# Altium schematic sheet Pg06_ SysBoot_LEDS_Mech.SchDoc: SYSBOOT LED SENSORS
size A2; DocumentNumber: 6; SheetNumber: 6; SheetTotal: 16
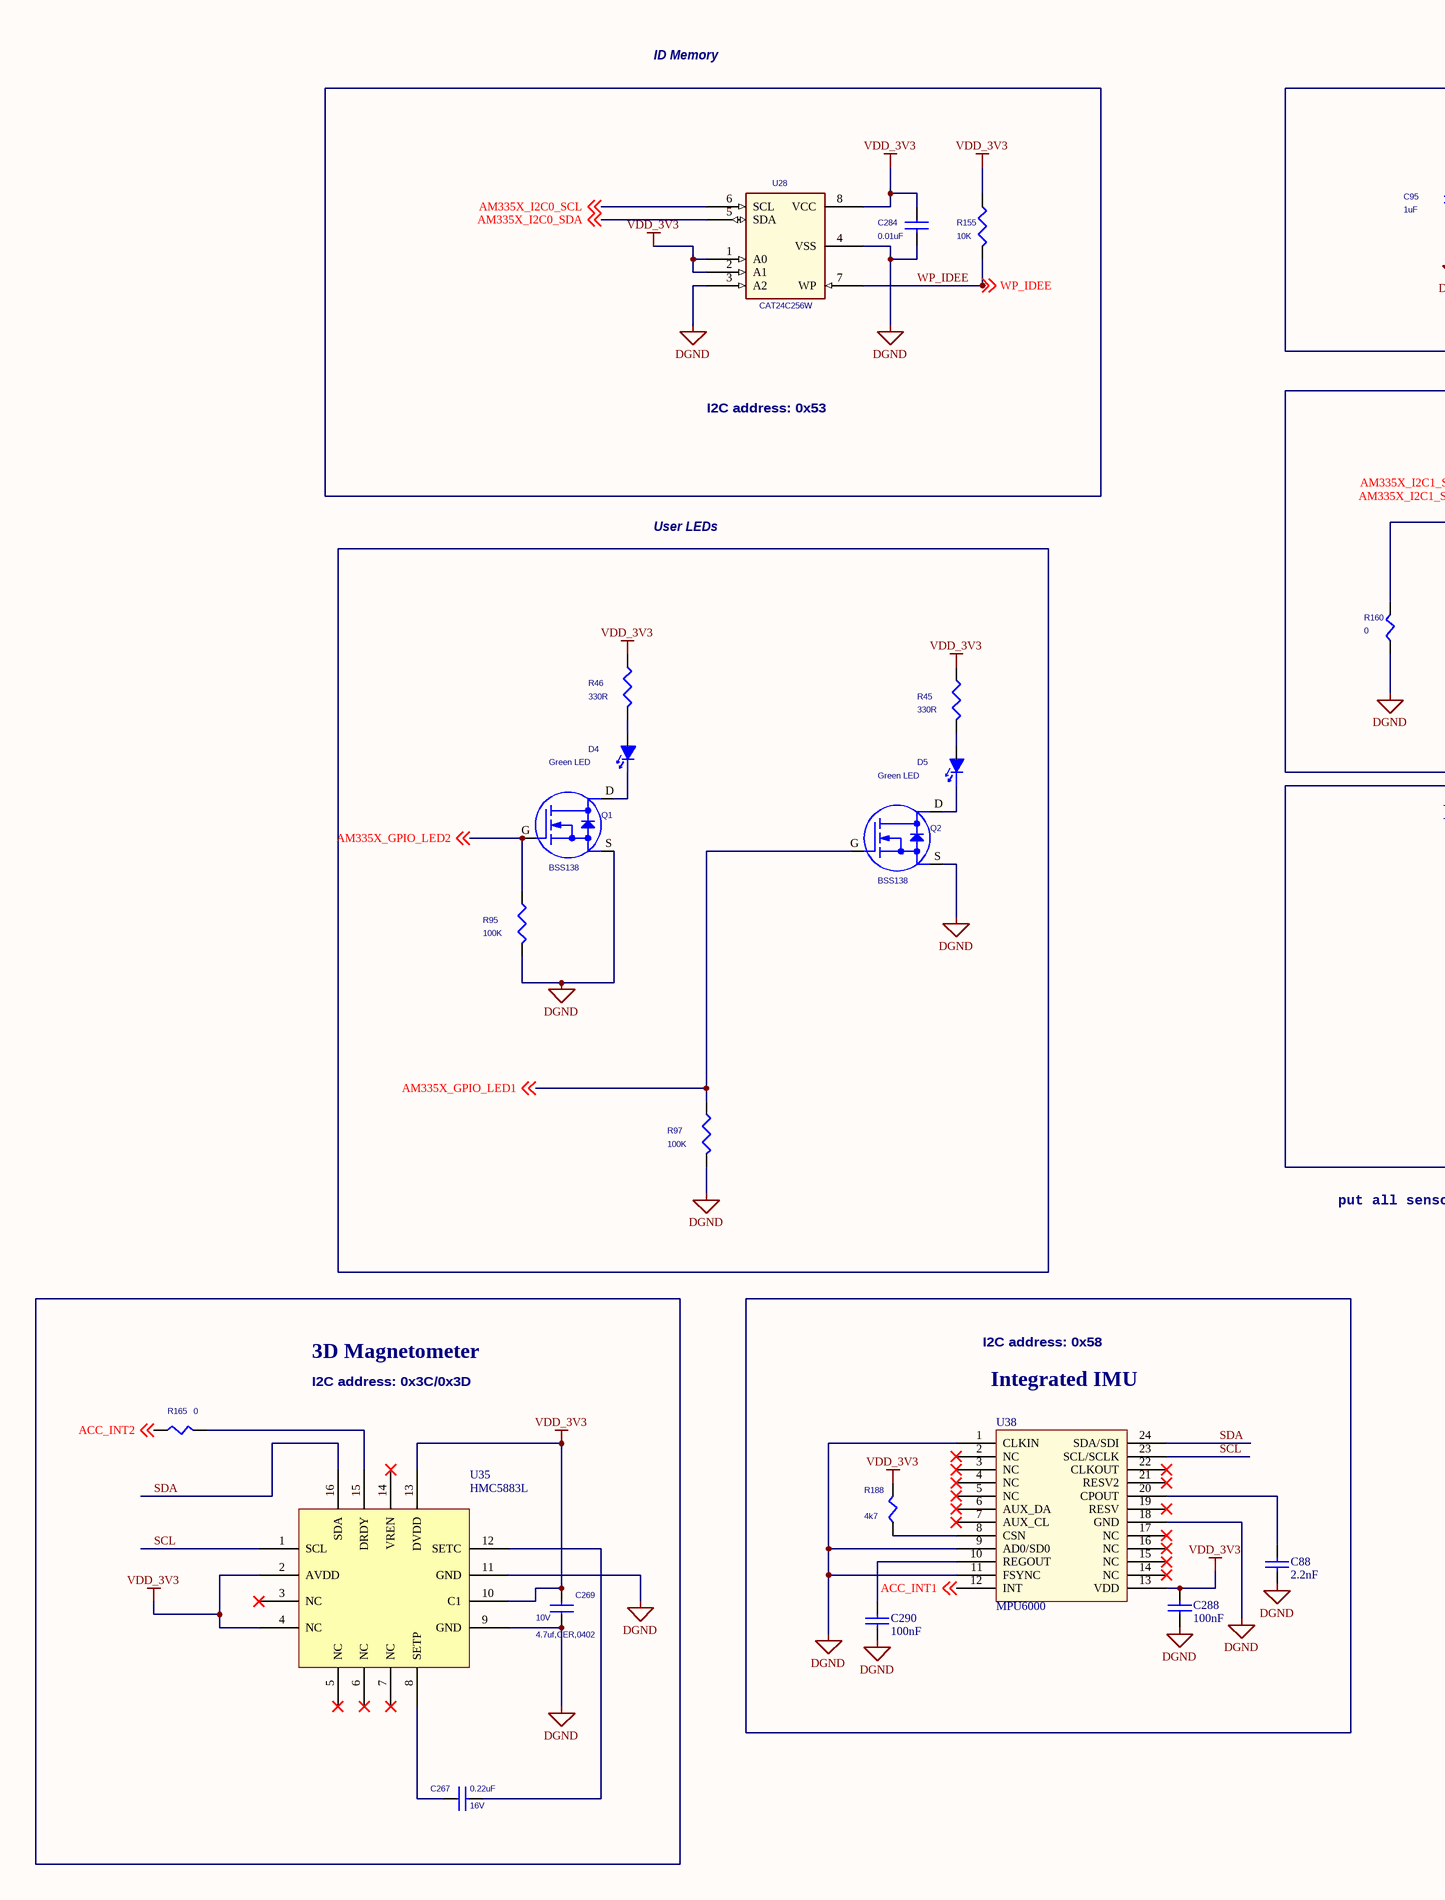
[diagram p0: Pg06_ SysBoot_LEDS_Mech.SchDoc, left]
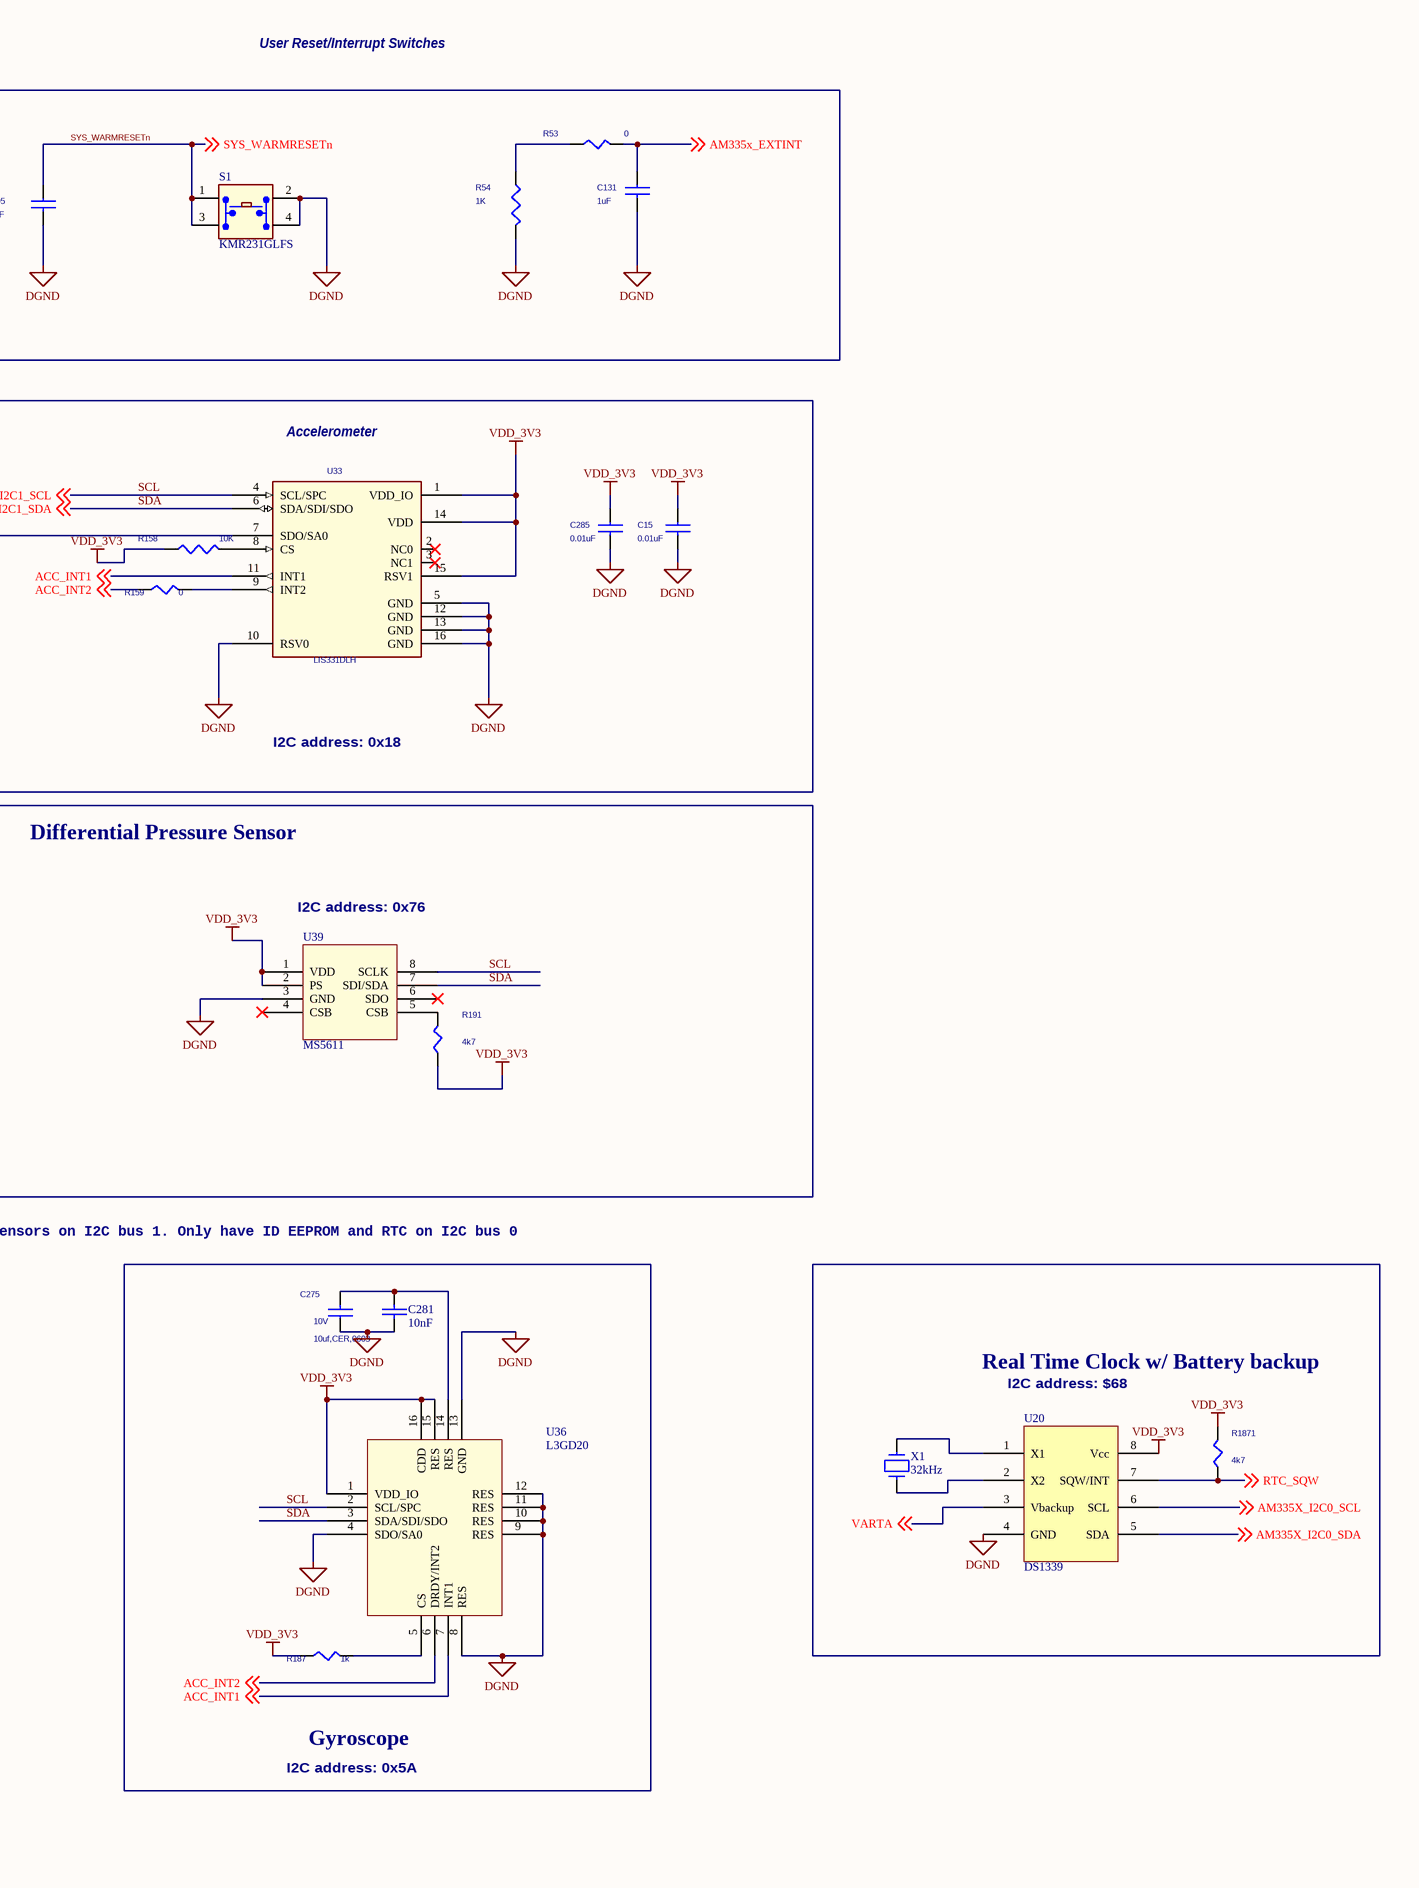
[diagram p1: Pg06_ SysBoot_LEDS_Mech.SchDoc, right]

## Parts
?  (no value)  (graphical)
C15  0.01uF  [SM-7351-CAP-0402]
C88  2.2nF  [0603]
C95  1uF  [SM-7351-CAP-0402]
C131  1uF  [SM-7351-CAP-0402]
C267  0.22uF  Voltage: 16V  [sc0402]
C269  4.7uf,CER,0402  Voltage: 10V  [sc0402]
C275  10uf,CER,0603  Voltage: 10V  [0603]
C281  10nF  [SM-7351-CAP-0402]
C284  0.01uF  [SM-7351-CAP-0402]
C285  0.01uF  [SM-7351-CAP-0402]
C288  100nF  [0603]
C290  100nF  [0603]
D4  Green LED  [sm_led_0805]
D5  Green LED  [sm_led_0805]
Q1  BSS138  [SOT23-3]
Q2  BSS138  [SOT23-3]
R45  330R  [SM-7351-RES-0402]
R46  330R  [SM-7351-RES-0402]
R53  0  [SM-7351-RES-0402]
R54  1K  [SM-7351-RES-0402]
R95  100K  [SM-7351-RES-0402]
R97  100K  [SM-7351-RES-0402]
R155  10K  [SM-7351-RES-0402]
R158  10K  [SM-7351-RES-0402]
R159  0  [SM-7351-RES-0402]
R160  0  [SM-7351-RES-0402]
R165  0  [SM-7351-RES-0402]
R187  1k  [SM-7351-RES-0402]
R188  4k7  [SM-7351-RES-0402]
R191  4k7  [SM-7351-RES-0402]
R1871  4k7  [SM-7351-RES-0402]
S1  KMR231GLFS  [SW4SMD_63X161LS]
U20  DS1339  [MSOP-MS8_N]
U28  CAT24C256W  [SOIC_8]
U33  LIS331DLH  [LGA16pin_3x3]
U35  HMC5883L  [LPCC package]
U36  L3GD20  [LCC 16pin 4x4mm 0.65mm pitch]
U38  MPU6000  [QFN_EPAD_24]
U39  MS5611  [MS5611-01BA03]
X1  32kHz  [Xtal 3215]

## Blocks framed on the sheet
I2C address: 0x53: C284 R155 U28
Accelerometer: C15 C285 R158-R160 U33
User LEDs: D4 D5 Q1 Q2 R45 R46 R95 R97
Differential Pressure Sensor: R191 U39
Gyroscope: C275 C281 R187 U36
Real Time Clock w/ Battery backup: R1871 U20 X1
3D Magnetometer: C267 C269 R165 U35
Integrated IMU: C88 C288 C290 R188 U38

## Nets
DGND: C15.2 C88.2 C95.2 C131.2 C269.1 C275.1 C281.2 C284.2 C285.2 C288.2 C290.2 Q1.S(SOURCE) Q2.S(SOURCE) R54.1(P1) R95.1(P1) R97.1(P1) R160.2(P2) S1.2(A2) S1.4 U20.4(GND) U28.3(A2) U28.4(VSS) U33.5(GND) U33.10(RSV0) U33.12(GND) U33.13(GND) U33.16(GND) U35.9(GND) U35.11(GND) U36.4(SDO/SA0) U36.8(RES) U36.9(RES) U36.10(RES) U36.11(RES) U36.12(RES) U36.13(GND) U38.1(CLKIN) U38.9(AD0/SD0) U38.11(FSYNC) U38.18(GND) U39.3(GND)
VDD_3V3: C15.1 C269.2 C284.1 C285.1 C288.1 R45.2(P2) R46.2(P2) R155.2(P2) R158.2(P2) R187.2(P2) R188.1(P1) R191.2(P2) R1871.1(P1) U20.8(Vcc) U28.1(A0) U28.2(A1) U28.8(VCC) U33.1(VDD_IO) U33.14(VDD) U33.15(RSV1) U35.2(AVDD) U35.4(NC) U35.10(C1) U35.13(DVDD) U36.1(VDD_IO) U36.15(RES) U36.16(CDD) U38.13(VDD) U39.1(VDD) U39.2(PS)
ACC_INT1: U33.11(INT1) U36.7(INT1) U38.12(INT) ; off-sheet ACC_INT1
ACC_INT2: R159.2(P2) R165.2(P2) U36.6(DRDY/INT2) ; off-sheet ACC_INT2
AM335x_EXTINT: C131.1 R53.1(P1) ; off-sheet AM335x_EXTINT
AM335X_GPIO_LED1: Q2.G(GATE) R97.2(P2) ; off-sheet AM335X_GPIO_LED1
AM335X_GPIO_LED2: Q1.G(GATE) R95.2(P2) ; off-sheet AM335X_GPIO_LED2
AM335X_I2C0_SCL: U20.6(SCL) U28.6(SCL) ; off-sheet AM335X_I2C0_SCL
AM335X_I2C0_SDA: U20.5(SDA) U28.5(SDA) ; off-sheet AM335X_I2C0_SDA
RTC_SQW: R1871.2(P2) U20.7(SQW/INT) ; off-sheet RTC_SQW
SCL: U33.4(SCL/SPC) U35.1(SCL) U36.2(SCL/SPC) U38.23(SCL/SCLK) U39.8(SCLK) ; off-sheet AM335X_I2C1_SCL  [also labelled AM335X_I2C1_SCL]
SDA: U33.6(SDA/SDI/SDO) U35.16(SDA) U36.3(SDA/SDI/SDO) U38.24(SDA/SDI) U39.7(SDI/SDA) ; off-sheet AM335X_I2C1_SDA  [also labelled AM335X_I2C1_SDA]
SYS_WARMRESETn: C95.1 S1.1(A1) S1.3(A3) ; off-sheet SYS_WARMRESETn
VARTA: U20.3(Vbackup) ; off-sheet VARTA
WP_IDEE: R155.1(P1) U28.7(WP) ; off-sheet WP_IDEE
NetC88_1: C88.1 U38.20(CPOUT)
NetC267_1: C267.1 U35.8(SETP)
NetC267_2: C267.2 U35.12(SETC)
NetC275_2: C275.2 C281.1 U36.14(RES)
NetC290_1: C290.1 U38.10(REGOUT)
NetD4_1: D4.1(Cathode) Q1.D(DRAIN)
NetD4_2: D4.2(Anode) R46.1(P1)
NetD5_1: D5.1(Cathode) Q2.D(DRAIN)
NetD5_2: D5.2(Anode) R45.1(P1)
NetR53_2: R53.2(P2) R54.2(P2)
NetR158_1: R158.1(P1) U33.8(CS)
NetR159_1: R159.1(P1) U33.9(INT2)
NetR160_1: R160.1(P1) U33.7(SDO/SA0)
NetR165_1: R165.1(P1) U35.15(DRDY)
NetR187_1: R187.1(P1) U36.5(CS)
NetR188_2: R188.2(P2) U38.8(CSN)
NetR191_1: R191.1(P1) U39.5(CSB)
NetU20_1: U20.1(X1) X1.2
NetU20_2: U20.2(X2) X1.1

Not connected (* = marked no-connect by the designer): U33 2(NC0)* 3(NC1)*; U35 3(NC)* 5(NC)* 6(NC)* 7(NC)* 14(VREN)*; U38 2(NC)* 3(NC)* 4(NC)* 5(NC)* 6(AUX_DA)* 7(AUX_CL)* 14(NC)* 15(NC)* 16(NC)* 17(NC)* 19(RESV)* 21(RESV2)* 22(CLKOUT)*; U39 4(CSB)* 6(SDO)*

## Notes on the sheet
- ID Memory
- User Reset/Interrupt Switches
- I2C address: 0x18
- I2C address: 0x76
- put all sensors on I2C bus 1. Only have ID EEPROM and RTC on I2C bus 0
- I2C address: 0x3C/0x3D
- I2C address: 0x58
- I2C address: $68
- I2C address: 0x5A
- Embedded Vision Systems Group
- Title
- School of Electrical and Electronic Engineering
- Date:
- Size
- Document Number
- Sheet
- of
- Rev

## Library data of the parts
? = Title Block Address(1): UoM title block
C15 C284 C285 = 0.01uFCapacitor16V10%0402_Dup1: Mfr: Panasonic; PartName: 0.01uF16V10%SMD0402; MfrNum: ECJ-0YB1C103K; TIIntPartnumber: 1C0012; PN: 0402YC103KAT2A; TN: 207-0054-000; Vendor: Digikey; Cost100: 0.00; Cost10K: 0.015; DescriptiveText: Capacitor 0.01uF 16V 10% 0402
C88 C281 C288 C290 = CAP_CER: Ceramic capacitor
C95 C131 = 1uFCapacitor10V10%0402_Dup1: PartName: 1uF10V10%0402; Mfr: AVX; MfrNum: 0402ZD105KAT2A; TIIntPartnumber: 1C0084; Vendor: Digikey; Cost100: 0.336; Cost10K: 0.201; DescriptiveText: Capacitor 1uF 10V Ceramic 10% 0402
C267 = 0402_0r01uf_x7r_16v_10: TN: 207-0054-000; Desc: CAP, CER, X7R, 0402, 16V, 10%, 0.01uF
C269 C275 = cap_0402_0r1uf_x7r_10v: Desc: CAP, CER, X7R, 0402, 10V, 10%, 0.1uF
D4 D5 = LED_Green: TIIntPartnumber: 1F0008; MfrNum: 598-8170-107F; Mfr: Dialight; PartName: LEDGreen2x1.5; DescriptiveText: LED Green SMD 20mA 2V 0805; Cost10K: 0.0370; Cost100: 0.081; Vendor: Digikey
Q1 Q2 = MOSFET_NChan_BSS138_Dup1: MOSFET Nchan 50V 200mA; TIIntPartnumber: 1Q0019; MfrNum: BSS138-7-F; Mfr: Diodes Inc.; Cost10K: 0.030; Cost100: 0.18; Vendor: Digikey; TN: 289-0091-000; Descriptive_Text: MOSFET Nchan 50V 200mA; PartName: MOSFET_NChan_BSS138; DescriptiveText: MOSFET Nchan 50V 200mA
R45 R46 = 150ohm1/16W1%SMD0402: Resistor 150ohm 1/16W 5% 0402; Mfr: Stackpole Electronics; MfrNum: RMCF0402JT150R; TIIntPartnumber: 1R0179; Vendor: Digikey; Cost100: 0.011; Cost10K: 0.00132; DescriptiveText: Resistor 150ohm 1/16W 5% 0402; PartName: 150ohm1/16W5%0402; Descriptive_Text: Resistor 150ohm 1/16W 5% 0402
R53 = ZeroOhmResistor1/16W0402_Dup1: Resistor Zero ohm Jumper 0402; TIIntPartnumber: 1R0098; MfrNum: ERJ-2GE0R00X; Mfr: Panasonic; PartName: ZeroohmSMD0402; Cost10K: 0.0020; Cost100: 0.08; Vendor: DIGIKEY; Descriptive_Text: Resistor Zero ohm Jumper 0402; DescriptiveText: Resistor Zero ohm Jumper 0402
R54 = 1KOhmResistor1/16W0402_Dup1: Resistor 1Kohm 1/16W 5% 0402; PartName: 1KOHM1/16W5%SMD; Mfr: Panasonic; MfrNum: ERJ-2GEJ102X; TIIntPartnumber: 1R0027; Vendor: DIGIKEY; Cost100: 0.02595; Descriptive_Text: Resistor 1Kohm 1/16W 5% 0402; Cost10K: 0.02595; DescriptiveText: Resistor 1Kohm 1/16W 5% 0402
R95 R97 = 100KOhmResistor1/16W0402_Dup1: TIIntPartnumber: 1R0181; MfrNum: RMCF0402FT100K; Mfr: Stackpole Electronics; PartName: 100Kohm1/16W1%SMD0402; DescriptiveText: Resistor 100Kohm 1/16W 1% 0402; Cost10K: 0.0020; Cost100: 0.0105; Vendor: Digikey
R155 R158 = 10KOhmResistor1/16W0402_Dup1: Resistor 10Kohm 1/16W 5% 0402; TIIntPartnumber: 1R0168; MfrNum: MCR01MZPJ103; Mfr: Rohm; PartName: 10Kohm1/16W5%SMD0402; Cost10K: 0.0017; Cost100: 0.03; Vendor: Digikey; Descriptive_Text: Resistor 10Kohm 1/16W 5% 0402; DescriptiveText: Resistor 10Kohm 1/16W 5% 0402
R159 R165 R187 R188 R191 R1871 = ZeroOhmResistor1/16W0402: PartName: ZeroohmSMD0402; Mfr: Panasonic; MfrNum: ERJ-2GE0R00X; TIIntPartnumber: 1R0098; DescriptiveText: Resistor Zero ohm Jumper 0402; Vendor: Digikey; Cost100: 0.08; Cost10K: 0.0020
R160 = ZeroOhmResistor1/16W0402_Dup4: Resistor Zero ohm Jumper 0402; TIIntPartnumber: 1R0098; MfrNum: ERJ-2GE0R00X; Mfr: Panasonic; PartName: ZeroohmSMD0402; Cost10K: 0.0020; Cost100: 0.08; Vendor: Digikey; Descriptive_Text: Resistor Zero ohm Jumper 0402; DescriptiveText: Resistor Zero ohm Jumper 0402
S1 = KMR2: Microminiature Tact Switch for SMT; Manufacturer: C&K Components; Circuit: SPST-NO; Switch Function: Off-Mom; Contact Rating @ Voltage: 0.05A @ 32VDC; Actuator Type: Standard; Actuator Height off PCB, from Pins: 1.90mm; Actuator Orientation: Top Actuated; Outline: 4.60mm x 2.80mm; Illumination: Non-Illuminated; Operating Force: 300gf; Switch Travel: 0.25mm; Mechanical Life: 150,000 Cycles; Supplier 1: Digi-Key; Supplier Part Number 1: 401-1429-6-ND; Manufacturer Part Number: KMR231GLFS; RoHS: RoHS Compliant; Category: Switches; Stock 1: 32289; Pricing 1: 1=0.44, 10=0.416, 25=0.3744, 50=0.3326, 100=0.3188, 250=0.29108, 500=0.2772, 1000=0.22869 (USD); Mounting Type: Surface Mount; Termination Style: Gull Wing; Illumination Voltage (Nominal): -; Illumination Type, Color: -; Ingress Protection: -; Features: Grounding Pin; Packaging: Digi-Reel®; Actuator Material: -; Operating Temperature: -40°C ~ 85°C; ComponentLink1URL: http://www.ck-components.com/index.php?module=media&action=Display&cmpref=14414&lang=en&width=&height=&format=&alt=; ComponentLink1Description: http://www.ck-components.com/index.php?module=media&action=Display&cmpref=14414&lang=en&width=&height=&format=&alt=
U20 = DS1339: DS1339 RTC; Farnell: 1379717
U28 = CAT24C256W: EEPROM 256Kb I2C SOIC8; TIIntPartnumber: 1A0225; MfrNum: CAT24C256WI-G; Mfr: On Semiconductor; Cost10K: 0.36; Cost100: 1.21; Vendor: Digikey; DescriptiveText: EEPROM 256Kb I2C SOIC8; PartName: CAT24C256W; Descriptive_Text: EEPROM 256Kb I2C SOIC8
U33 = LIS331DLH: Accelerometer 3 Axis I2C; Mfr: ST Microelectronics; TIIntPartnumber: 1A0227; Vendor: Digikey; Cost100: 8.05; Cost10K: 2.25; DescriptiveText: Accelerometer 3 Axis I2C; PartName: LIS331DLH; MfrNum: LIS331DLH; Descriptive_Text: Accelerometer 3 Axis I2C
U35 = HMC5883L: 3D Magnetometer
U38 = IMU6000: Invensemse 6-axis MPU; supplier: Digikey  1428-1005-1-ND
U39 = MS5611: Pressure Sensor; supplier: Avnet
X1 = CRYSTAL